# EAGLE design ESP32E_Double_RGB_RevA (EAGLE 9.6.2)
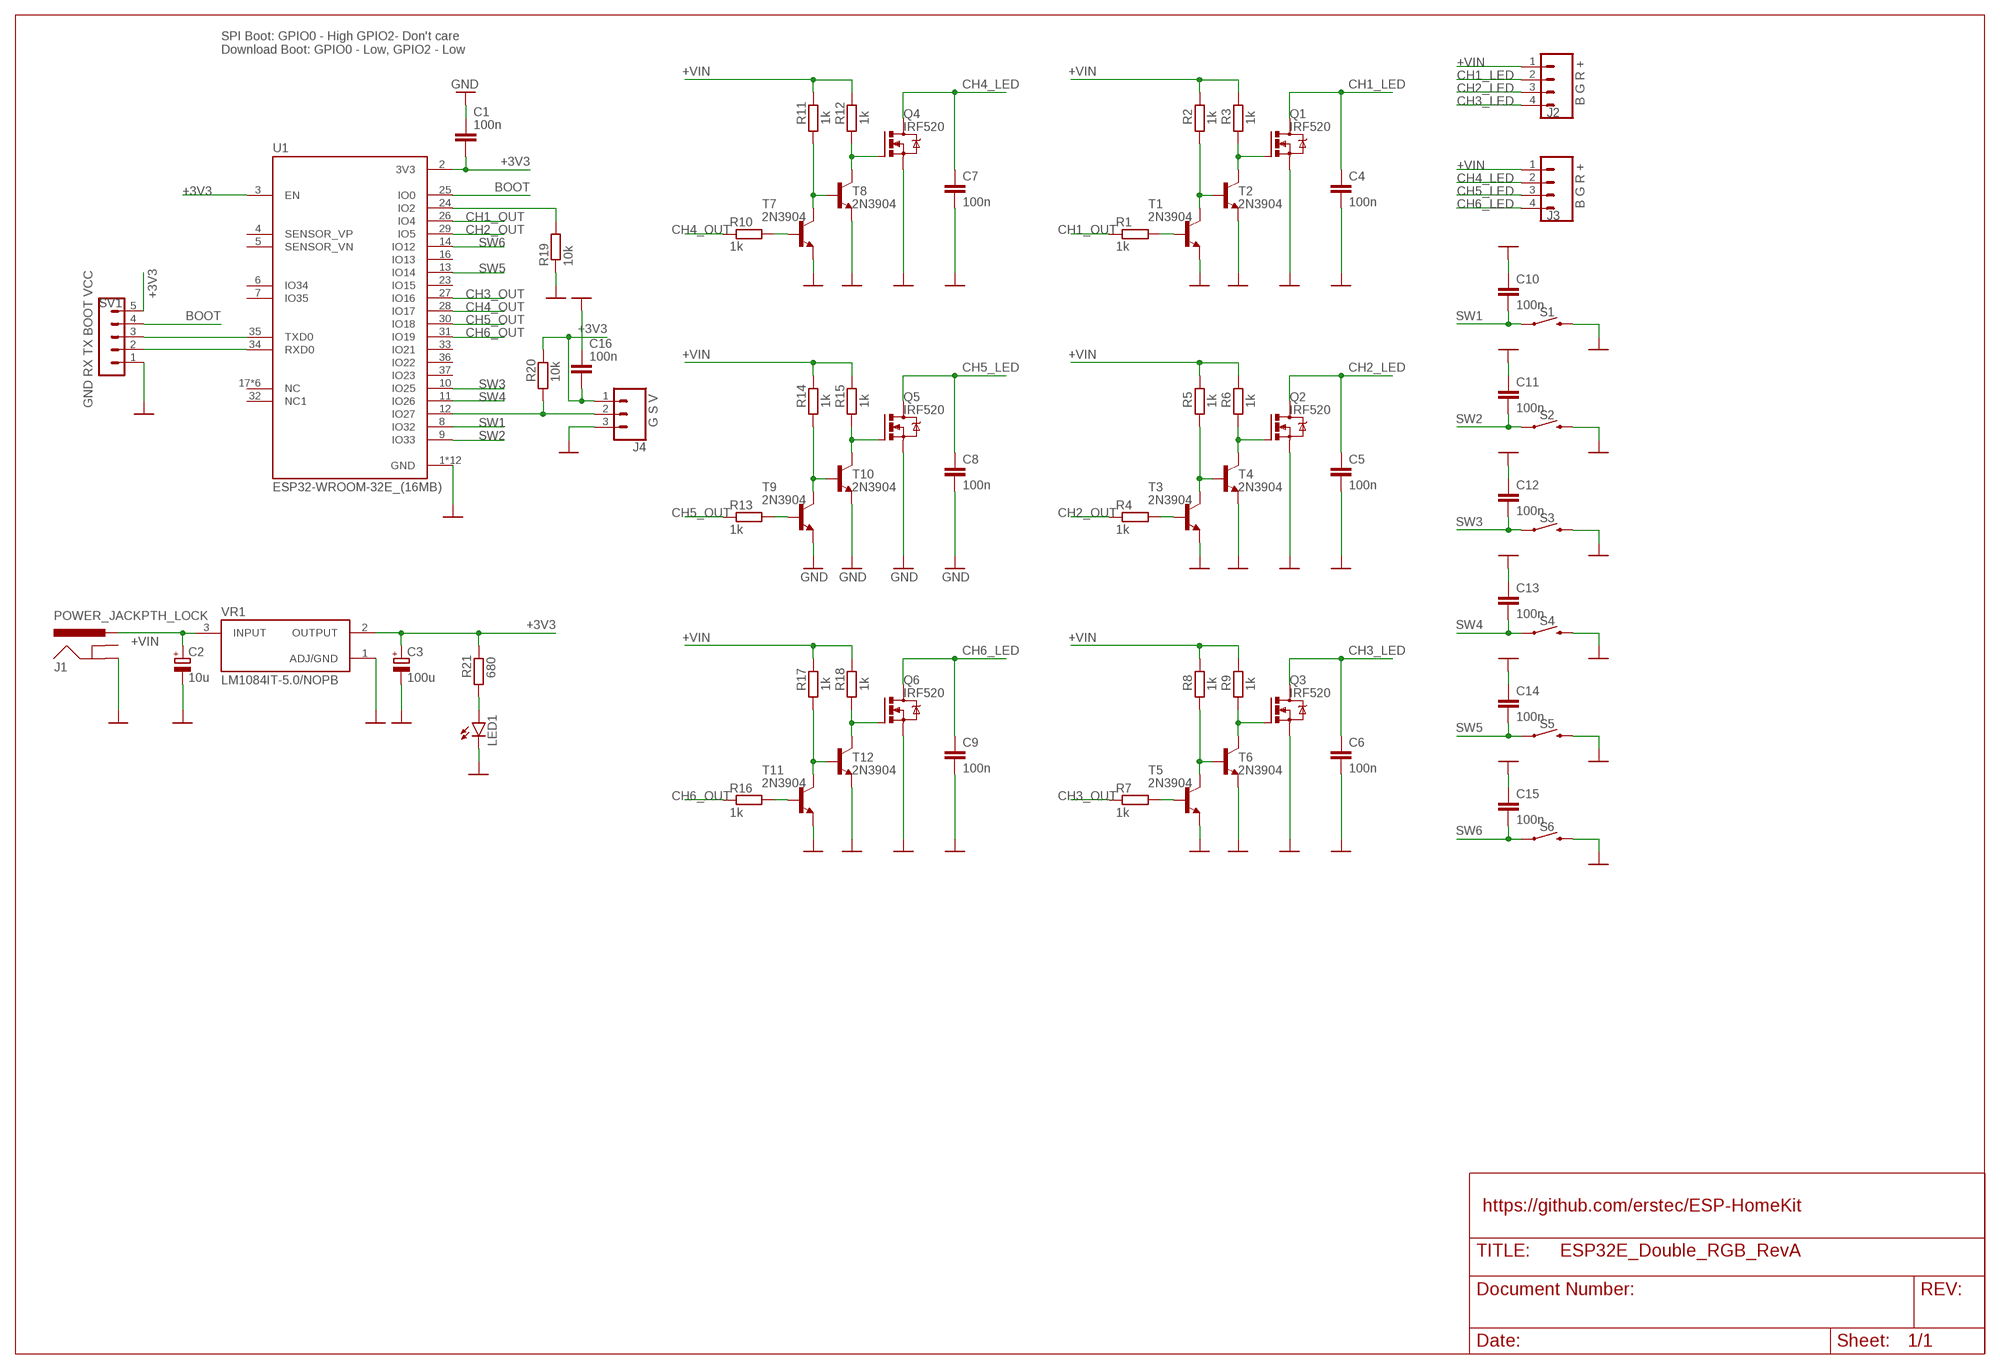
[diagram p0: schematic, sheet 1]

## Parts
C1  100n  C-EU025-024X044  [C025-024X044]
C2  10u  CPOL-EUE2,5-6E  [E2,5-6E]
C3  100u  CPOL-EUE2.5-6  [E2,5-6]
C4  100n  C-EU025-024X044  [C025-024X044]
C5  100n  C-EU025-024X044  [C025-024X044]
C6  100n  C-EU025-024X044  [C025-024X044]
C7  100n  C-EU025-024X044  [C025-024X044]
C8  100n  C-EU025-024X044  [C025-024X044]
C9  100n  C-EU025-024X044  [C025-024X044]
C10  100n  C-EU025-024X044  [C025-024X044]
C11  100n  C-EU025-024X044  [C025-024X044]
C12  100n  C-EU025-024X044  [C025-024X044]
C13  100n  C-EU025-024X044  [C025-024X044]
C14  100n  C-EU025-024X044  [C025-024X044]
C15  100n  C-EU025-024X044  [C025-024X044]
C16  100n  C-EU025-024X044  [C025-024X044]
J1  POWER_JACKPTH_LOCK  [POWER_JACK_PTH_LOCK]
J2  B G R +  CONN_04SCREW_LOCK  [SCREWTERMINAL-3.5MM-4_LOCK]
J3  B G R +  CONN_04SCREW_LOCK  [SCREWTERMINAL-3.5MM-4_LOCK]
J4  G S V  CONN_03SCREW_LOCK  [SCREWTERMINAL-3.5MM-3_LOCK.007S]
LED1  LED5MM  [LED5MM]
Q1  IRF520  [TO220BV]
Q2  IRF520  [TO220BV]
Q3  IRF520  [TO220BV]
Q4  IRF520  [TO220BV]
Q5  IRF520  [TO220BV]
Q6  IRF520  [TO220BV]
R1  1k  R-EU_0207/10  [0207/10]
R2  1k  R-EU_0207/10  [0207/10]
R3  1k  R-EU_0207/10  [0207/10]
R4  1k  R-EU_0207/10  [0207/10]
R5  1k  R-EU_0207/10  [0207/10]
R6  1k  R-EU_0207/10  [0207/10]
R7  1k  R-EU_0207/10  [0207/10]
R8  1k  R-EU_0207/10  [0207/10]
R9  1k  R-EU_0207/10  [0207/10]
R10  1k  R-EU_0207/10  [0207/10]
R11  1k  R-EU_0207/10  [0207/10]
R12  1k  R-EU_0207/10  [0207/10]
R13  1k  R-EU_0207/10  [0207/10]
R14  1k  R-EU_0207/10  [0207/10]
R15  1k  R-EU_0207/10  [0207/10]
R16  1k  R-EU_0207/10  [0207/10]
R17  1k  R-EU_0207/10  [0207/10]
R18  1k  R-EU_0207/10  [0207/10]
R19  10k  R-EU_0207/10  [0207/10]
R20  10k  R-EU_0207/10  [0207/10]
R21  680  R-EU_0207/10  [0207/10]
S1  MOMENTARY-SWITCH-SPST-PTH-6.0MM  [TACTILE_SWITCH_PTH_6.0MM]
S2  MOMENTARY-SWITCH-SPST-PTH-6.0MM  [TACTILE_SWITCH_PTH_6.0MM]
S3  MOMENTARY-SWITCH-SPST-PTH-6.0MM  [TACTILE_SWITCH_PTH_6.0MM]
S4  MOMENTARY-SWITCH-SPST-PTH-6.0MM  [TACTILE_SWITCH_PTH_6.0MM]
S5  MOMENTARY-SWITCH-SPST-PTH-6.0MM  [TACTILE_SWITCH_PTH_6.0MM]
S6  MOMENTARY-SWITCH-SPST-PTH-6.0MM  [TACTILE_SWITCH_PTH_6.0MM]
SV1  GND RX TX BOOT VCC  MA05-1  [MA05-1]
T1  2N3904  [TO92]
T2  2N3904  [TO92]
T3  2N3904  [TO92]
T4  2N3904  [TO92]
T5  2N3904  [TO92]
T6  2N3904  [TO92]
T7  2N3904  [TO92]
T8  2N3904  [TO92]
T9  2N3904  [TO92]
T10  2N3904  [TO92]
T11  2N3904  [TO92]
T12  2N3904  [TO92]
U1  ESP32-WROOM-32E_(16MB)  [XCVR_ESP32-WROOM-32E_(16MB)]
VR1  LM1084IT-5.0/NOPB  [TO254P1054X470X1955-3]

## Nets
+3V3: C1.2 C3.+ C16.2 J4.1 R20.2 R21.2 SV1.5 U1.2(3V3) U1.3(EN) VR1.2(OUTPUT)
+VIN: C2.+ J1.PWR J2.1 J3.1 R2.2 R3.2 R5.2 R6.2 R8.2 R9.2 R11.2 R12.2 R14.2 R15.2 R17.2 R18.2 VR1.3(INPUT)
BOOT: SV1.4 U1.25(IO0)
CH1_LED: C4.1 J2.2 Q1.D
CH1_OUT: R1.1 U1.26(IO4)
CH2_LED: C5.1 J2.3 Q2.D
CH2_OUT: R4.1 U1.29(IO5)
CH3_LED: C6.1 J2.4 Q3.D
CH3_OUT: R7.1 U1.27(IO16)
CH4_LED: C7.1 J3.2 Q4.D
CH4_OUT: R10.1 U1.28(IO17)
CH5_LED: C8.1 J3.3 Q5.D
CH5_OUT: R13.1 U1.30(IO18)
CH6_LED: C9.1 J3.4 Q6.D
CH6_OUT: R16.1 U1.31(IO19)
GND: C1.1 C2.- C3.- C4.2 C5.2 C6.2 C7.2 C8.2 C9.2 C10.1 C11.1 C12.1 C13.1 C14.1 C15.1 C16.1 J1.GND J4.3 LED1.K(C) Q1.S Q2.S Q3.S Q4.S Q5.S Q6.S R19.1 S1.3 S2.3 S3.3 S4.3 S5.3 S6.3 SV1.1 T1.3(E) T2.3(E) T3.3(E) T4.3(E) T5.3(E) T6.3(E) T7.3(E) T8.3(E) T9.3(E) T10.3(E) T11.3(E) T12.3(E) U1.1(GND) U1.15(GND) U1.38(GND) U1.39_1(GND) U1.39_2(GND) U1.39_3(GND) U1.39_4(GND) U1.39_5(GND) U1.39_6(GND) U1.39_7(GND) U1.39_8(GND) U1.39_9(GND) VR1.1(ADJ/GND)
N$1: R2.1 T1.1(C) T2.2(B)
N$2: R1.2 T1.2(B)
N$3: LED1.A R21.1
N$4: Q1.G R3.1 T2.1(C)
N$5: J4.2 R20.1 U1.12(IO27)
N$8: SV1.2 U1.34(RXD0)
N$9: SV1.3 U1.35(TXD0)
N$10: R5.1 T3.1(C) T4.2(B)
N$11: R4.2 T3.2(B)
N$13: Q2.G R6.1 T4.1(C)
N$16: R8.1 T5.1(C) T6.2(B)
N$17: R7.2 T5.2(B)
N$19: Q3.G R9.1 T6.1(C)
N$22: R11.1 T7.1(C) T8.2(B)
N$23: R10.2 T7.2(B)
N$25: Q4.G R12.1 T8.1(C)
N$28: R14.1 T9.1(C) T10.2(B)
N$29: R13.2 T9.2(B)
N$31: Q5.G R15.1 T10.1(C)
N$34: R17.1 T11.1(C) T12.2(B)
N$35: R16.2 T11.2(B)
N$37: Q6.G R18.1 T12.1(C)
N$40: R19.2 U1.24(IO2)
SW1: C10.2 S1.1 U1.8(IO32)
SW2: C11.2 S2.1 U1.9(IO33)
SW3: C12.2 S3.1 U1.10(IO25)
SW4: C13.2 S4.1 U1.11(IO26)
SW5: C14.2 S5.1 U1.13(IO14)
SW6: C15.2 S6.1 U1.14(IO12)
Unconnected: J1.GNDBREAK U1.4(SENSOR_VP) U1.5(SENSOR_VN) U1.6(IO34) U1.7(IO35) U1.16(IO13) U1.17(NC) U1.18(NC) U1.19(NC) U1.20(NC) U1.21(NC) U1.22(NC) U1.23(IO15) U1.32(NC1) U1.33(IO21) U1.36(IO22) U1.37(IO23)

## Notes on the sheet
- SPI Boot: GPIO0 - High GPIO2- Don't care
  Download Boot: GPIO0 - Low, GPIO2 - Low
- https://github.com/erstec/ESP-HomeKit

## Library data of the parts
C1 C4-C16 = rcl:C-EU: CAPACITOR, European symbol; SPICEPREFIX: C
C2 C3 = rcl:CPOL-EU: POLARIZED CAPACITOR, European symbol; SPICEPREFIX: C
J1 = SparkFun-Connectors:POWER_JACK: Power Jack Connector This is the standard 5.5mm barrel jack for power. The PTH is the most common, proven, reliable, footprint. The Slot footprint only works if the mill layer is transmitted to the PCB fab house so be warned. Here are the connectors we sell at SparkFun: DC Barrel Power Jack/Connector <https://www.sparkfun.com/products/119> (PRT-00119) DC Barrel Power Jack/Connector (SMD) <https://www.sparkfun.com/products/12748> (PRT-12748) DC Barrel Jack Adapter - Breadboard Compatible <https://www.sparkfun.com/products/10811> (PRT-10811) It is used on this SparkFun product (and many, many others): SparkFun RedBoard - Programmed with Arduino <https://www.sparkfun.com/products/12757> (DEV-12757) Also, if you need a mating power supply or connector, please check these out: Wall Adapter Power Supply - 9VDC 650mA <https://www.sparkfun.com/products/298> (TOL-00298) DC Barrel Jack Adapter - Male <https://www.sparkfun.com/products/10287> (PRT-10287); PROD_ID: CONN-08197; SF_ID: PRT-00119
J2 J3 = SparkFun-Connectors:CONN_04: Multi connection point. Often used as Generic Header-pin footprint for 0.1 inch spaced/style header connections On any of the 0.1 inch spaced packages, you can populate with these: Break Away Headers - Straight <https://www.sparkfun.com/products/116> (PRT-00116) Break Away Male Headers - Right Angle <https://www.sparkfun.com/products/553> (PRT-00553) Female Headers <https://www.sparkfun.com/products/115> (PRT-00115) Break Away Headers - Machine Pin <https://www.sparkfun.com/products/117> (PRT-00117) Break Away Female Headers - Swiss Machine Pin <https://www.sparkfun.com/products/743> (PRT-00743) For SCREWTERMINALS and SPRING TERMINALS visit here: Screw Terimnals on SparkFun.com <https://www.sparkfun.com/search/results?term=Screw+Terminals> (5mm/3.5mm/2.54mm spacing) This device is also useful as a general connection point to wire up your design to another part of your project. Our various solder wires solder well into these plated through hole pads. Hook-Up Wire - Assortment (Stranded, 22 AWG) <https://www.sparkfun.com/products/11375> (PRT-11375) Hook-Up Wire - Assortment (Solid Core, 22 AWG) <https://www.sparkfun.com/products/11367> (PRT-11367) View the entire wire category on our website here <https://www.sparkfun.com/categories/141> Special notes: Molex polarized connector foot print use with SKU : PRT-08231 with associated crimp pins and housings. 1MM SMD Version SKU: PRT-10208
J4 = SparkFun-Connectors:CONN_03: Multi connection point. Often used as Generic Header-pin footprint for 0.1 inch spaced/style header connections On any of the 0.1 inch spaced packages, you can populate with these: Break Away Headers - Straight <https://www.sparkfun.com/products/116> (PRT-00116) Break Away Male Headers - Right Angle <https://www.sparkfun.com/products/553> (PRT-00553) Female Headers <https://www.sparkfun.com/products/115> (PRT-00115) Break Away Headers - Machine Pin <https://www.sparkfun.com/products/117> (PRT-00117) Break Away Female Headers - Swiss Machine Pin <https://www.sparkfun.com/products/743> (PRT-00743) Stackable Header - 3 Pin (Female, 0.1") <https://www.sparkfun.com/products/13875> (PRT-13875) For SCREWTERMINALS and SPRING TERMINALS visit here: Screw Terimnals on SparkFun.com <https://www.sparkfun.com/search/results?term=Screw+Terminals> (5mm/3.5mm/2.54mm spacing) This device is also useful as a general connection point to wire up your design to another part of your project. Our various solder wires solder well into these plated through hole pads. Hook-Up Wire - Assortment (Stranded, 22 AWG) <https://www.sparkfun.com/products/11375> (PRT-11375) Hook-Up Wire - Assortment (Solid Core, 22 AWG) <https://www.sparkfun.com/products/11367> (PRT-11367) View the entire wire category on our website here <https://www.sparkfun.com/categories/141> Special notes: Molex polarized connector foot print use with SKU : PRT-08232 with associated crimp pins and housings.; PROD_ID: CONN-08288; SF_ID: PRT-08235
LED1 = led:LED: LED OSRAM: - CHIPLED LG R971, LG N971, LY N971, LG Q971, LY Q971, LO R971, LY R971 LH N974, LH R974 LS Q976, LO Q976, LY Q976 LO Q996 - Hyper CHIPLED LW Q18S LB Q993, LB Q99A, LB R99A - SideLED LS A670, LO A670, LY A670, LG A670, LP A670 LB A673, LV A673, LT A673, LW A673 LH A674 LY A675 LS A676, LA A676, LO A676, LY A676, LW A676 LS A679, LY A679, LG A679 - Hyper Micro SIDELED® LS Y876, LA Y876, LO Y876, LY Y876 LT Y87S - SmartLED LW L88C, LW L88S LB L89C, LB L89S, LG L890 LS L89K, LO L89K, LY L89K LS L896, LA L896, LO L896, LY L896 - TOPLED LS T670, LO T670, LY T670, LG T670, LP T670 LSG T670, LSP T670, LSY T670, LOP T670, LYG T670 LG T671, LOG T671, LSG T671 LB T673, LV T673, LT T673, LW T673 LH T674 LS T676, LA T676, LO T676, LY T676, LB T676, LH T676, LSB T676, LW T676 LB T67C, LV T67C, LT T67C, LS T67K, LO T67K, LY T67K, LW E67C LS E67B, LA E67B, LO E67B, LY E67B, LB E67C, LV E67C, LT E67C LW T67C LS T679, LY T679, LG T679 LS T770, LO T770, LY T770, LG T770, LP T770 LB T773, LV T773, LT T773, LW T773 LH T774 LS E675, LA E675, LY E675, LS T675 LS T776, LA T776, LO T776, LY T776, LB T776 LHGB T686 LT T68C, LB T68C - Hyper Mini TOPLED® LB M676 - Mini TOPLED Santana® LG M470 LS M47K, LO M47K, LY M47K Source: http://www.osram.convergy.de LUXEON: - LUMILED® LXK2-PW12-R00, LXK2-PW12-S00, LXK2-PW14-U00, LXK2-PW14-V00 LXK2-PM12-R00, LXK2-PM12-S00, LXK2-PM14-U00 LXK2-PE12-Q00, LXK2-PE12-R00, LXK2-PE12-S00, LXK2-PE14-T00, LXK2-PE14-U00 LXK2-PB12-K00, LXK2-PB12-L00, LXK2-PB12-M00, LXK2-PB14-N00, LXK2-PB14-P00, LXK2-PB14-Q00 LXK2-PR12-L00, LXK2-PR12-M00, LXK2-PR14-Q00, LXK2-PR14-R00 LXK2-PD12-Q00, LXK2-PD12-R00, LXK2-PD12-S00 LXK2-PH12-R00, LXK2-PH12-S00 LXK2-PL12-P00, LXK2-PL12-Q00, LXK2-PL12-R00 Source: www.luxeon.com KINGBRIGHT: KA-3528ASYC Source: www.kingbright.com
Q1-Q6 = transistor-power:IRF520: HEXFET Power MOSFET
R1-R21 = rcl:R-EU_: RESISTOR, European symbol; SPICEPREFIX: R
S1-S6 = SparkFun-Switches:MOMENTARY-SWITCH-SPST: Momentary Switch (Pushbutton) - SPST Normally-open (NO) SPST momentary switches (buttons, pushbuttons). Variants PTH-12MM - 12mm square, through-hole Momentary Pushbutton Switch - 12mm Square <https://www.sparkfun.com/products/9190> (COM-09190) PTH-6.0MM, PTH-6.0MM-KIT - 6.0mm square, through-hole Mini Pushbutton Switch <https://www.sparkfun.com/products/97> (COM-00097) KIT package intended for soldering kit's - only one side of pads' copper is exposed. PTH-RIGHT-ANGLE-KIT - Right-angle, through-hole Right Angle Tactile Button <https://www.sparkfun.com/products/10791> - Used on SparkFun BigTime Watch Kit <https://www.sparkfun.com/products/11734> SMD-12MM - 12mm square, surface-mount Tactile Button - SMD (12mm) <https://www.sparkfun.com/products/12993> (COM-12993) Used on SparkFun PicoBoard <https://www.sparkfun.com/products/11888> SMD-4.5MM - 4.5mm Square Trackball Switch Used on SparkFun Blackberry Trackballer Breakout <https://www.sparkfun.com/products/13169> SMD-4.6MMX2.8MM - 4.60mm x 2.80mm, surface mount Used on SparkFun Pro Micro - RP2040 <https://www.sparkfun.com/products/17717> SMD-5.2MM, SMD-5.2-REDUNDANT - 5.2mm square, surface-mount Mini Pushbutton Switch - SMD <https://www.sparkfun.com/products/8720> (COM-08720) Used on Arduino Pro Mini <https://www.sparkfun.com/products/11114> REDUNDANT package connects both switch circuits together SMD-6.0X3.5MM - 6.0 x 3.5mm, surface mount Momentary Reset Switch SMD <https://www.sparkfun.com/products/8229> (COM-08229) SMD-6.2MM-TALL - 6.2mm square, surface mount Tactile Button - SMD (6mm) <https://www.sparkfun.com/products/12992> Used on SparkFun Digital Sandbox <https://www.sparkfun.com/products/12651> SMD-RIGHT-ANGLE - Right-angle, surface mount Used on SparkFun Block for Intel® Edison - Arduino <https://www.sparkfun.com/products/13036>; PROD_ID: SWCH-08441; SF_SKU: COM-00097
SV1 = con-lstb:MA05-1: PIN HEADER; OC_FARNELL: unknown; OC_NEWARK: unknown
T1-T12 = transistor:2N3904: NPN TRANSISTOR
U1 = ESP32-WROOM-32E__16MB_:ESP32-WROOM-32E_(16MB): Check availability <https://pricing.snapeda.com/parts/ESP32-WROOM-32E%20%2816MB%29/Espressif%20Systems/view-part?ref=eda>; AVAILABILITY: Not in stock; DESCRIPTION: Bluetooth, WiFi 802.11b/g/n, Bluetooth v4.2 +EDR, Class 1, 2 and 3 Transceiver Module 2.4GHz ~ 2.5GHz Integrated, Trace Surface Mount; MF: Espressif Systems; MP: ESP32-WROOM-32E (16MB); PACKAGE: None; PRICE: None
VR1 = LM1084IT-5.0_NOPB:LM1084IT-5.0/NOPB: Check availability <https://pricing.snapeda.com/parts/LM1084IT-5.0/NOPB/Texas%20Instruments/view-part?ref=eda>; AVAILABILITY: In Stock; DESCRIPTION: 5.5-A, 29-V, linear voltage regulator; MF: Texas Instruments; MP: LM1084IT-5.0/NOPB; PACKAGE: TO-220-3 Texas Instruments; PRICE: None; PURCHASE-URL: https://pricing.snapeda.com/search/part/LM1084IT-5.0/NOPB/?ref=eda

## Board
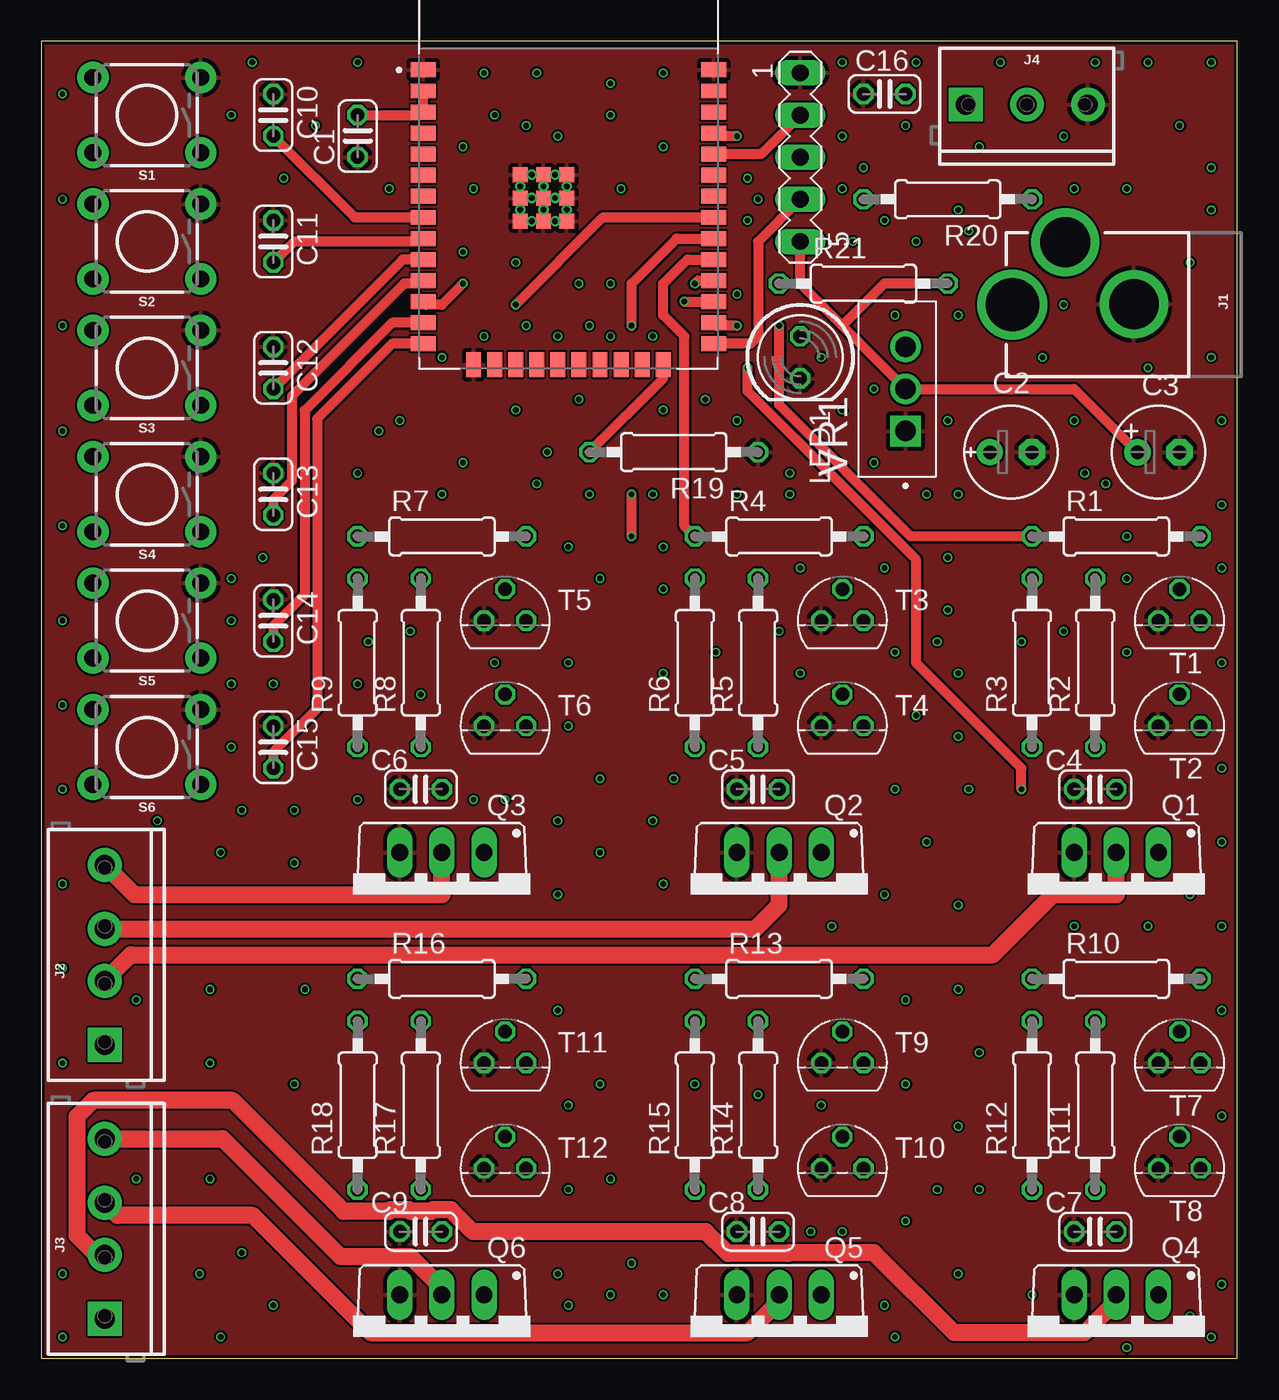
[diagram p1: board, top side]
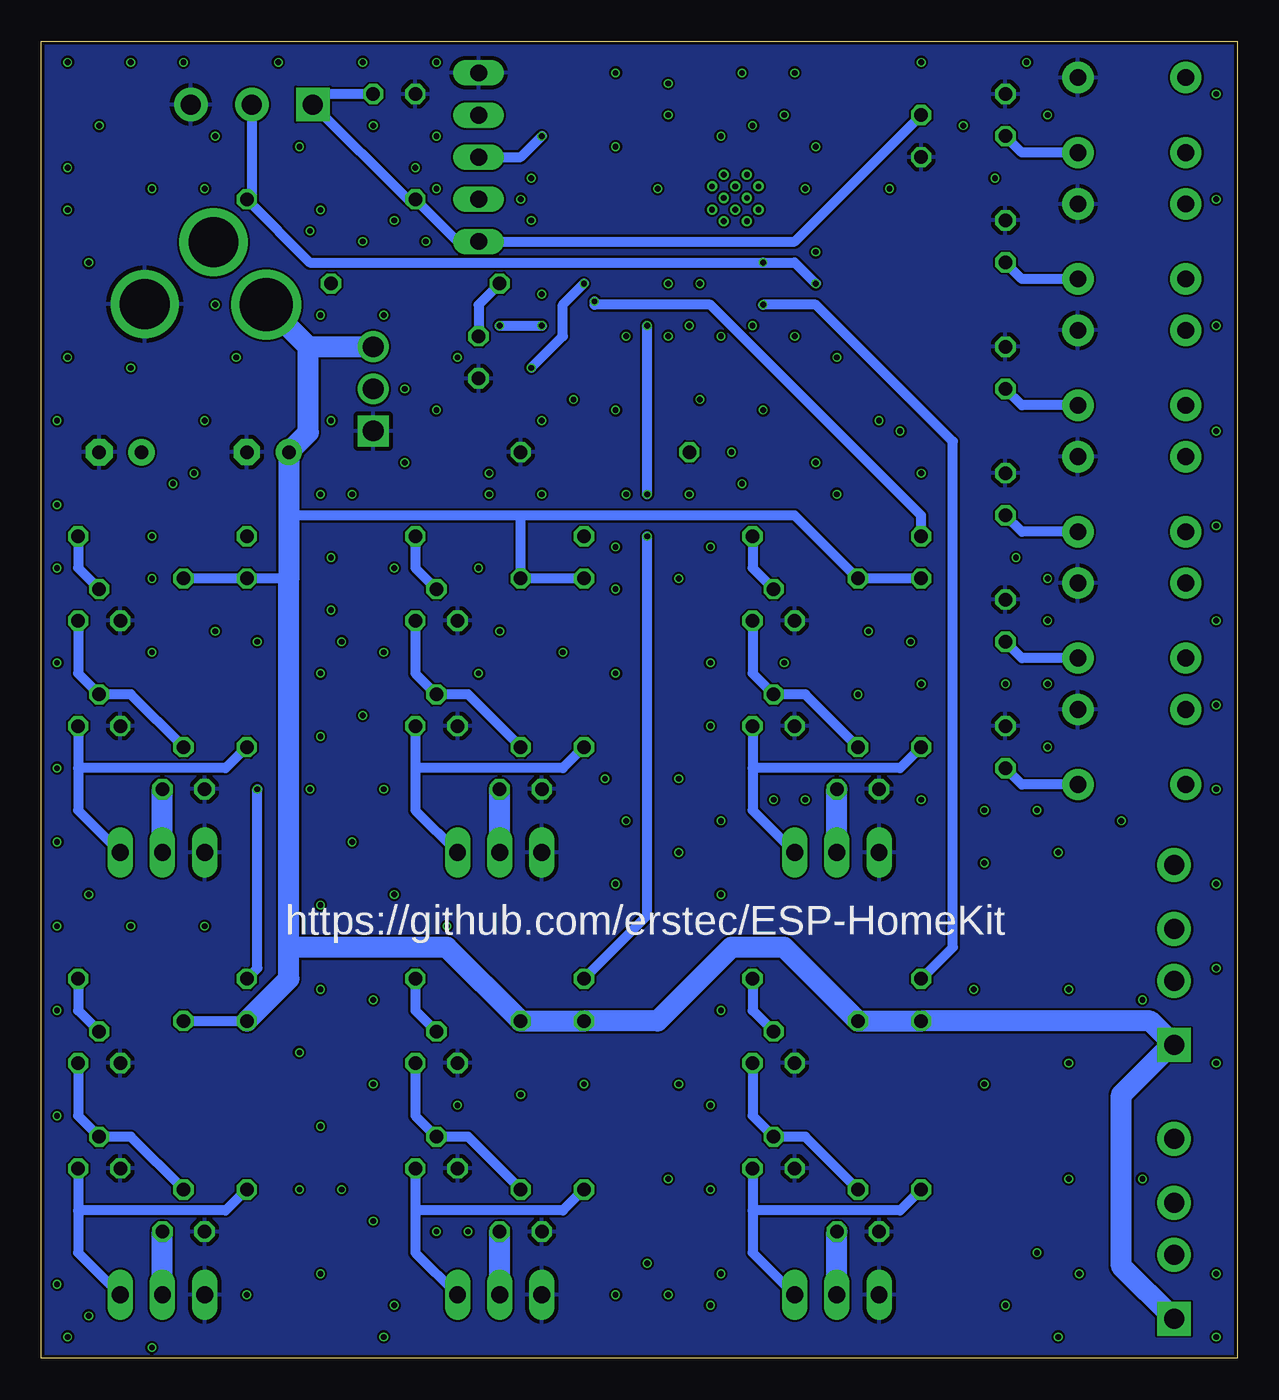
[diagram p2: board, bottom side, seen from below]

Size 72.06 x 79.36 mm. Coordinates in mm from the lower left corner, seen from the top.
Outline: 0,0 72.06,0 72.06,79.36 0,79.36 0,0
Copper layers (1*16): Top 0.035559375mm / dielectric 1.6mm / Bottom 0.035559375mm
Design rules "jlcpcb-2layers": minimum track width 5mil, minimum drill 12mil, track to track 5mil, track to pad 5mil, pad to pad 5mil, via to via 5mil, smd to smd 5mil, copper to edge 8mil, drill to drill 6mil, minimum pad ring 5mil, minimum via ring 3mil, stop-mask expansion 2.5mil, vias tented up to drill 0mil, thermal gap 10mil

### Footprints (pad centres in the part's own frame; a part is rotated, then mirrored left to right if it is on the bottom)
C025-024X044 = drill 0.813 octagon: 1 -1.27,0; 2 1.27,0
E2,5-6E = drill 0.813 pad 1.575: + -1.27,0 | drill 0.813 pad 1.575 octagon: - 1.27,0
E2,5-6 = drill 0.813 pad 1.6: + -1.27,0 | drill 0.813 pad 1.6 octagon: - 1.27,0
POWER_JACK_PTH_LOCK = drill 2.997 pad 4.115: GND 0.025,6.557; GNDBREAK 3.762,10.7 | drill 3.2 pad 4.115: PWR 0,13.878
SCREWTERMINAL-3.5MM-4_LOCK = drill 1.2 pad 2.032 square: 1 -0.178,0 | drill 1.2 pad 2.032: 2 3.678,0; 3 6.822,0; 4 10.678,0
SCREWTERMINAL-3.5MM-3_LOCK.007S = drill 1.2 pad 2.032 square: 1 -0.178,0 | drill 1.2 pad 2.032: 2 3.5,0; 3 7.178,0
LED5MM = drill 0.813 octagon: A -1.27,0; K 1.27,0
TO220BV = drill 1.016 long: D 0,-2.54; G -2.54,-2.54; S 2.54,-2.54
0207/10 = drill 0.813 octagon: 1 -5.08,0; 2 5.08,0
TACTILE_SWITCH_PTH_6.0MM = drill 1.016 pad 1.88: 1 -3.251,2.261; 2 3.251,2.261; 3 -3.251,-2.261; 4 3.251,-2.261
MA05-1 = drill 1.016 long: 1 -5.08,0; 2 -2.54,0; 3 0,0; 4 2.54,0; 5 5.08,0
TO92 = drill 0.813 octagon: 1 1.27,0; 2 0,1.905; 3 -1.27,0
XCVR_ESP32-WROOM-32E_(16MB) = smd 1.5 x 0.9: 1 -8.75,5.26; 2 -8.75,3.99; 3 -8.75,2.72; 4 -8.75,1.45; 5 -8.75,0.18; 6 -8.75,-1.09; 7 -8.75,-2.36; 8 -8.75,-3.63; 9 -8.75,-4.9; 10 -8.75,-6.17; 11 -8.75,-7.44; 12 -8.75,-8.71; 13 -8.75,-9.98; 14 -8.75,-11.25; 25 8.75,-11.25; 26 8.75,-9.98; 27 8.75,-8.71; 28 8.75,-7.44; 29 8.75,-6.17; 30 8.75,-4.9; 31 8.75,-3.63; 32 8.75,-2.36; 33 8.75,-1.09; 34 8.75,0.18; 35 8.75,1.45; 36 8.75,2.72; 37 8.75,3.99; 38 8.75,5.26 | smd 0.9 x 1.5: 15 -5.715,-12.5; 16 -4.445,-12.5; 17 -3.175,-12.5; 18 -1.905,-12.5; 19 -0.635,-12.5; 20 0.635,-12.5; 21 1.905,-12.5; 22 3.175,-12.5; 23 4.445,-12.5; 24 5.715,-12.5 | smd 0.9 x 0.9: 39_1 -2.9,-1.06; 39_2 -1.5,-1.06; 39_3 -0.1,-1.06; 39_4 -2.9,-2.46; 39_5 -1.5,-2.46; 39_6 -0.1,-2.46; 39_7 -2.9,-3.86; 39_8 -1.5,-3.86; 39_9 -0.1,-3.86 | drill 0.35 pad 0.61: 39_10 -2.2,-1.06; 39_11 -0.8,-1.06; 39_12 -2.9,-1.76; 39_13 -1.5,-1.76; 39_14 -0.1,-1.76; 39_15 -2.2,-2.46; 39_16 -0.8,-2.46; 39_17 -2.9,-3.16; 39_18 -1.5,-3.16; 39_19 -0.1,-3.16; 39_20 -2.2,-3.86; 39_21 -0.8,-3.86
TO254P1054X470X1955-3 = drill 1.24 square: 1 -2.54,0 | drill 1.24: 2 0,0; 3 2.54,0

### Placement (x,y rotation side)
C1  19.05,73.66 90 top
C2  58.42,54.61 0 top
C3  67.31,54.61 0 top
C4  63.5,34.29 180 top
C5  43.18,34.29 180 top
C6  22.86,34.29 180 top
C7  63.5,7.62 180 top
C8  43.18,7.62 180 top
C9  22.86,7.62 180 top
C10  13.97,74.93 270 top
C11  13.97,67.31 270 top
C12  13.97,59.69 270 top
C13  13.97,52.07 270 top
C14  13.97,44.45 270 top
C15  13.97,36.83 270 top
C16  50.8,76.2 0 top
J1  72.39,63.5 90 top
J2  3.81,19.05 90 top
J3  3.81,2.54 90 top
J4  55.88,75.56 0 top
LED1  45.72,60.33 270 top
Q1  64.77,27.94 180 top
Q2  44.45,27.94 180 top
Q3  24.13,27.94 180 top
Q4  64.77,1.27 180 top
Q5  44.45,1.27 180 top
Q6  24.13,1.27 180 top
R1  64.77,49.53 0 top
R2  63.5,41.91 90 top
R3  59.69,41.91 90 top
R4  44.45,49.53 0 top
R5  43.18,41.91 90 top
R6  39.37,41.91 90 top
R7  24.13,49.53 0 top
R8  22.86,41.91 90 top
R9  19.05,41.91 90 top
R10  64.77,22.86 0 top
R11  63.5,15.24 90 top
R12  59.69,15.24 90 top
R13  44.45,22.86 0 top
R14  43.18,15.24 90 top
R15  39.37,15.24 90 top
R16  24.13,22.86 0 top
R17  22.86,15.24 90 top
R18  19.05,15.24 90 top
R19  38.1,54.61 180 top
R20  54.61,69.85 180 top
R21  49.53,64.77 0 top
S1  6.35,74.93 180 top
S2  6.35,67.31 180 top
S3  6.35,59.69 180 top
S4  6.35,52.07 180 top
S5  6.35,44.45 180 top
S6  6.35,36.83 180 top
SV1  45.72,72.39 270 top
T1  68.58,44.45 0 top
T2  68.58,38.1 0 top
T3  48.26,44.45 0 top
T4  48.26,38.1 0 top
T5  27.94,44.45 0 top
T6  27.94,38.1 0 top
T7  68.58,17.78 0 top
T8  68.58,11.43 0 top
T9  48.26,17.78 0 top
T10  48.26,11.43 0 top
T11  27.94,17.78 0 top
T12  27.94,11.43 0 top
U1  31.75,72.39 0 top
VR1  52.07,58.42 90 top

### Tracks (layer width: path | path; a pad name or v marks a point on that pad's centre or on a via)
+3V3
  Top 0.61: C1.2 22.82,74.93 U1.3 U1.2 | C3.+ 62.23,58.42 VR1.2 48.26,62.23 | 48.26,62.23 45.72,64.77 SV1.5 | R21.2 50.8,64.77 48.26,62.23
  Bottom 0.61: C1.2 26.67,67.31 SV1.5 46.99,67.31 R20.2 49.99,69.85 J4.1 55.07,76.2 C16.2
+VIN
  Bottom 0.61: R11.2 R12.2 | R9.2 R8.2 26.67,50.8 43.18,50.8 | R6.2 R5.2 43.18,50.8 | R2.2 R3.2 57.15,46.99 | 43.18,50.8 57.15,50.8
  Bottom 1.27: J1.PWR 55.97,60.96 | 55.97,60.96 VR1.3 | 55.97,60.96 55.97,55.79 C2.+ 57.15,50.8 57.15,46.99 57.15,24.77 | R12.2 57.15,22.86 57.15,24.77 | 57.15,24.77 47.62,24.77 R14.2 R15.2 34.92,20.32 30.48,24.77 27.3,24.77 R17.2 R18.2 5.26,20.32 J2.1 3.99,18.87 6.99,15.88 6.99,5.54 J3.1
BOOT
  Top 0.61: SV1.4 43.18,67.31 43.18,61.59 42.73,61.14 U1.25
CH1_LED
  Top 1.016: J2.2 5.39,24.31 57.33,24.31 60.96,27.94 64.77,27.94 Q1.D
  Bottom 1.27: Q1.D C4.1
CH1_OUT  (via drill 0.35)
  Top 0.61: R1.1 52.38,49.53 44.45,57.46 v44.45,62.23 | v41.91,62.23 40.68,62.23 U1.26
  Bottom 0.61: v44.45,62.23 v41.91,62.23
CH2_LED
  Top 1.016: J2.3 43.02,25.87 44.45,27.3 Q2.D
  Bottom 1.27: Q2.D C5.1
CH2_OUT
  Top 0.61: R4.1 38.73,50.16 38.73,61.59 37.47,62.87 37.47,64.77 38.91,66.22 U1.29
CH3_LED
  Top 1.016: J2.4 5.6,27.94 24.13,27.94 Q3.D
  Bottom 1.27: Q3.D C6.1
CH3_OUT  (via drill 0.35)
  Top 0.61: v38.73,63.7 38.76,63.68 U1.27
  Bottom 0.61: R7.1 19.05,50.8 31.75,63.5 38.73,63.5 v38.73,63.7
CH4_LED
  Top 1.016: J3.2 3.31,6.22 2.13,7.4 2.13,14.55 3.12,15.53 11.52,15.53 18.21,8.84 20.94,8.84 21.04,8.94 22.14,8.94 22.24,8.84 23.48,8.84 23.58,8.94 24.68,8.94 26,7.62 40.04,7.62 41.36,6.3 45,6.3 45.05,6.35 50.16,6.35 54.99,1.52 62.87,1.52 64.77,3.43 Q4.D
  Bottom 1.27: Q4.D C7.1
CH4_OUT  (via drill 0.35)
  Top 0.61: v59.05,34.29 59.05,35.56 52.7,41.91 52.7,48.13 42.55,58.29 v42.55,59.69 | v39.37,64.77 39.55,64.95 U1.28
  Bottom 0.61: R10.1 59.05,23.5 v59.05,34.29 | v42.55,59.69 40.64,61.59 40.64,63.5 v39.37,64.77
CH5_LED
  Top 1.016: J3.3 4.57,8.6 12.74,8.6 19.81,1.52 42.55,1.52 44.45,3.43 Q5.D
  Bottom 1.27: Q5.D C8.1
CH5_OUT  (via drill 0.35)
  Top 0.61: v35.56,49.53 v35.56,52.07 | v35.56,62.23 35.56,64.77 38.28,67.49 U1.30
  Bottom 0.61: R13.1 35.56,26.67 v35.56,49.53 | v35.56,52.07 v35.56,62.23
CH6_LED
  Top 1.016: J3.4 10.91,13.22 18.01,6.12 22.23,6.12 24.13,4.22 Q6.D
  Bottom 1.27: Q6.D C9.1
CH6_OUT  (via drill 0.35)
  Top 0.61: v28.57,63.5 33.84,68.76 U1.31
  Bottom 0.61: R16.1 17.14,24.77 17.14,55.24 25.4,63.5 v28.57,63.5
GND
  Top 0.61: U1.39_5 U1.39_8
  pour Top: 0,79.38 72.39,79.38 72.39,0 0,0
  pour Bottom (rank 6): 0,79.38 72.39,79.38 72.39,0 0,0
N$1
  Bottom 0.61: T1.1 69.85,41.27 T2.2 66.67,40.01 R2.1
N$2
  Bottom 0.61: R1.2 69.85,47.62 T1.2
N$3
  Bottom 0.61: R21.1 45.72,63.5 LED1.A
N$4
  Bottom 0.61: T2.1 69.85,35.56 | 69.85,35.56 69.85,33.02 Q1.G | R3.1 60.96,35.56 69.85,35.56
N$5  (via drill 0.35)
  Top 0.61: v25.4,64.77 24.13,63.5 23.18,63.5 U1.12
  Bottom 0.61: J4.2 59.38,70.16 R20.1 55.88,66.04 v28.57,66.04 26.67,66.04 v25.4,64.77
N$6  (via drill 0.35)
  other vias: 1.27,76.2
N$7  (via drill 0.35)
  other vias: 1.27,69.85
N$8
  Top 0.61: SV1.2 43.36,72.57 U1.34
N$9  (via drill 0.35)
  Top 0.61: v41.91,73.66 40.68,73.66 U1.35
  Bottom 0.61: SV1.3 43.18,72.39 v41.91,73.66
N$10
  Bottom 0.61: T3.1 49.53,41.27 T4.2 46.35,40.01 R5.1
N$11
  Bottom 0.61: R4.2 49.53,47.62 T3.2
N$12  (via drill 0.35)
  other vias: 1.27,62.23
N$13
  Bottom 0.61: T4.1 49.53,35.56 | 49.53,35.56 49.53,33.02 Q2.G | R6.1 40.64,35.56 49.53,35.56
N$14  (via drill 0.35)
  other vias: 1.27,55.88
N$15  (via drill 0.35)
  other vias: 1.27,50.16
N$16
  Bottom 0.61: T5.1 29.21,41.27 T6.2 26.04,40.01 R8.1
N$17
  Bottom 0.61: R7.2 29.21,47.62 T5.2
N$18  (via drill 0.35)
  other vias: 1.27,44.45
N$19
  Bottom 0.61: T6.1 29.21,35.56 | 29.21,35.56 29.21,33.02 Q3.G | R9.1 20.32,35.56 29.21,35.56
N$20  (via drill 0.35)
  other vias: 1.27,39.37
N$21  (via drill 0.35)
  other vias: 1.27,34.29
N$22
  Bottom 0.61: T7.1 69.85,14.61 T8.2 66.67,13.34 R11.1
N$23
  Bottom 0.61: R10.2 69.85,20.95 T7.2
N$24  (via drill 0.35)
  other vias: 1.27,28.57
N$25
  Bottom 0.61: T8.1 69.85,8.89 | 69.85,8.89 69.85,6.35 Q4.G | R12.1 60.96,8.89 69.85,8.89
N$26  (via drill 0.35)
  other vias: 1.27,23.5
N$27  (via drill 0.35)
  other vias: 1.27,17.78
N$28
  Bottom 0.61: T9.1 49.53,14.61 T10.2 46.35,13.34 R14.1
N$29
  Bottom 0.61: R13.2 49.53,20.95 T9.2
N$30  (via drill 0.35)
  other vias: 1.27,5.08
N$31
  Bottom 0.61: T10.1 49.53,8.89 | 49.53,8.89 49.53,6.35 Q5.G | R15.1 40.64,8.89 49.53,8.89
N$32  (via drill 0.35)
  other vias: 1.27,1.27
N$33  (via drill 0.35)
  other vias: 10.79,1.27
N$34
  Bottom 0.61: T11.1 29.21,14.61 T12.2 26.04,13.34 R17.1
N$35
  Bottom 0.61: R16.2 29.21,20.95 T11.2
N$36  (via drill 0.35)
  other vias: 9.53,5.08
N$37
  Bottom 0.61: T12.1 29.21,8.89 | 29.21,8.89 29.21,6.35 Q6.G | R18.1 20.32,8.89 29.21,8.89
N$38  (via drill 0.35)
  other vias: 13.97,3.17
N$39  (via drill 0.35)
  other vias: 5.71,21.59
N$40
  Top 0.61: R19.2 37.47,59.05 U1.24
N$41  (via drill 0.35)
  other vias: 10.16,22.23
N$42  (via drill 0.35)
  other vias: 15.88,22.23
N$43  (via drill 0.35)
  other vias: 15.24,16.51
N$44  (via drill 0.35)
  other vias: 10.16,17.78
N$45  (via drill 0.35)
  other vias: 12.06,6.35
N$46  (via drill 0.35)
  other vias: 10.16,10.79
N$47  (via drill 0.35)
  other vias: 5.71,10.79
N$48  (via drill 0.35)
  other vias: 31.75,3.17
N$49  (via drill 0.35)
  other vias: 31.11,5.08
N$50  (via drill 0.35)
  other vias: 35.56,5.71
N$51  (via drill 0.35)
  other vias: 37.47,3.81
N$52  (via drill 0.35)
  other vias: 34.29,3.81
N$53  (via drill 0.35)
  other vias: 51.44,1.27
N$54  (via drill 0.35)
  other vias: 50.8,3.17
N$55  (via drill 0.35)
  other vias: 65.41,0.64
N$56  (via drill 0.35)
  other vias: 69.22,2.54
N$57  (via drill 0.35)
  other vias: 71.12,4.45
N$58  (via drill 0.35)
  other vias: 70.48,1.27
N$59  (via drill 0.35)
  other vias: 59.69,3.81
N$60  (via drill 0.35)
  other vias: 55.24,5.08
N$61  (via drill 0.35)
  other vias: 52.07,8.26
N$62  (via drill 0.35)
  other vias: 46.35,7.62
N$63  (via drill 0.35)
  other vias: 48.26,7.62
N$64  (via drill 0.35)
  other vias: 56.52,10.16
N$65  (via drill 0.35)
  other vias: 55.24,13.97
N$66  (via drill 0.35)
  other vias: 56.52,18.41
N$67  (via drill 0.35)
  other vias: 55.24,22.23
N$68  (via drill 0.35)
  other vias: 52.07,21.59
N$69  (via drill 0.35)
  other vias: 52.07,16.51
N$70  (via drill 0.35)
  other vias: 46.99,15.24
N$71  (via drill 0.35)
  other vias: 43.18,15.88
N$72  (via drill 0.35)
  other vias: 39.37,16.51
N$73  (via drill 0.35)
  other vias: 33.66,16.51
N$74  (via drill 0.35)
  other vias: 34.29,10.79
N$75  (via drill 0.35)
  other vias: 31.75,10.16
N$76  (via drill 0.35)
  other vias: 31.75,15.24
N$77  (via drill 0.35)
  other vias: 31.11,20.95
N$78  (via drill 0.35)
  other vias: 53.98,10.16
N$79  (via drill 0.35)
  other vias: 71.12,20.95
N$80  (via drill 0.35)
  other vias: 71.12,14.61
N$81  (via drill 0.35)
  other vias: 71.12,26.04
N$82  (via drill 0.35)
  other vias: 66.67,26.04
N$83  (via drill 0.35)
  other vias: 62.23,26.04
N$84  (via drill 0.35)
  other vias: 55.24,27.3
N$85  (via drill 0.35)
  other vias: 55.88,34.29
N$86  (via drill 0.35)
  other vias: 52.7,38.73
N$87  (via drill 0.35)
  other vias: 51.44,34.29
N$88  (via drill 0.35)
  other vias: 50.8,27.94
N$89  (via drill 0.35)
  other vias: 53.34,31.11
N$90  (via drill 0.35)
  other vias: 47.62,26.04
N$91  (via drill 0.35)
  other vias: 37.47,28.57
N$92  (via drill 0.35)
  other vias: 38.1,34.92
N$93  (via drill 0.35)
  other vias: 36.83,32.38
N$94  (via drill 0.35)
  other vias: 37.47,41.27
N$95  (via drill 0.35)
  other vias: 40.64,42.55
N$96  (via drill 0.35)
  other vias: 44.45,43.81
N$97  (via drill 0.35)
  other vias: 45.72,41.27
N$98  (via drill 0.35)
  other vias: 37.47,46.35
N$99  (via drill 0.35)
  other vias: 37.47,48.9
N$100  (via drill 0.35)
  other vias: 33.66,46.99
N$101  (via drill 0.35)
  other vias: 31.75,48.9
N$102  (via drill 0.35)
  other vias: 31.75,41.91
N$103  (via drill 0.35)
  other vias: 27.3,41.91
N$104  (via drill 0.35)
  other vias: 31.75,38.1
N$105  (via drill 0.35)
  other vias: 33.66,34.92
N$106  (via drill 0.35)
  other vias: 33.66,30.48
N$107  (via drill 0.35)
  other vias: 31.11,27.94
N$108  (via drill 0.35)
  other vias: 31.11,32.38
N$109  (via drill 0.35)
  other vias: 27.94,33.66
N$110  (via drill 0.35)
  other vias: 26.04,33.66
N$111  (via drill 0.35)
  other vias: 19.05,33.66
N$112  (via drill 0.35)
  other vias: 22.86,40.01
N$113  (via drill 0.35)
  other vias: 22.23,43.81
N$114  (via drill 0.35)
  other vias: 19.68,43.18
N$115  (via drill 0.35)
  other vias: 19.05,40.64
N$116  (via drill 0.35)
  other vias: 15.24,33.02
N$117  (via drill 0.35)
  other vias: 15.24,29.84
N$118  (via drill 0.35)
  other vias: 10.79,30.48
N$119  (via drill 0.35)
  other vias: 12.06,33.02
N$120  (via drill 0.35)
  other vias: 11.43,36.83
N$121  (via drill 0.35)
  other vias: 11.43,40.64
N$122  (via drill 0.35)
  other vias: 13.97,40.64
N$123  (via drill 0.35)
  other vias: 11.43,44.45
N$124  (via drill 0.35)
  other vias: 11.43,46.99
N$125  (via drill 0.35)
  other vias: 13.34,48.26
N$126  (via drill 0.35)
  other vias: 6.99,32.38
N$127  (via drill 0.35)
  other vias: 19.05,53.34
N$128  (via drill 0.35)
  other vias: 21.59,56.52
N$129  (via drill 0.35)
  other vias: 20.32,55.88
N$130  (via drill 0.35)
  other vias: 28.57,57.15
N$131  (via drill 0.35)
  other vias: 32.38,57.78
N$132  (via drill 0.35)
  other vias: 30.48,54.61
N$133  (via drill 0.35)
  other vias: 25.4,53.98
N$134  (via drill 0.35)
  other vias: 24.13,52.07
N$135  (via drill 0.35)
  other vias: 29.84,52.7
N$136  (via drill 0.35)
  other vias: 33.02,52.07
N$137  (via drill 0.35)
  other vias: 37.47,57.15
N$138  (via drill 0.35)
  other vias: 40.01,57.78
N$139  (via drill 0.35)
  other vias: 41.91,56.52
N$140  (via drill 0.35)
  other vias: 45.09,53.34
N$141  (via drill 0.35)
  other vias: 41.91,52.07
N$142  (via drill 0.35)
  other vias: 36.83,52.07
N$143  (via drill 0.35)
  other vias: 45.09,52.07
N$144  (via drill 0.35)
  other vias: 45.72,47.62
N$145  (via drill 0.35)
  other vias: 50.8,47.62
N$146  (via drill 0.35)
  other vias: 51.44,42.55
N$147  (via drill 0.35)
  other vias: 55.24,37.47
N$148  (via drill 0.35)
  other vias: 55.24,41.27
N$149  (via drill 0.35)
  other vias: 54.61,45.09
N$150  (via drill 0.35)
  other vias: 54.61,48.26
N$151  (via drill 0.35)
  other vias: 53.98,43.18
N$152  (via drill 0.35)
  other vias: 65.41,46.99
N$153  (via drill 0.35)
  other vias: 65.41,42.55
N$154  (via drill 0.35)
  other vias: 71.12,41.91
N$155  (via drill 0.35)
  other vias: 71.12,35.56
N$156  (via drill 0.35)
  other vias: 71.12,31.11
N$157  (via drill 0.35)
  other vias: 69.22,27.94
N$158  (via drill 0.35)
  other vias: 71.12,47.62
N$159  (via drill 0.35)
  other vias: 71.12,51.44
N$160  (via drill 0.35)
  other vias: 65.41,49.53
N$161  (via drill 0.35)
  other vias: 64.14,52.7
N$162  (via drill 0.35)
  other vias: 61.59,43.81
N$163  (via drill 0.35)
  other vias: 59.05,43.18
N$164  (via drill 0.35)
  other vias: 62.87,53.34
N$165  (via drill 0.35)
  other vias: 62.23,56.52
N$166  (via drill 0.35)
  other vias: 55.24,52.07
N$167  (via drill 0.35)
  other vias: 54.61,56.52
N$168  (via drill 0.35)
  other vias: 53.34,52.07
N$169  (via drill 0.35)
  other vias: 50.16,53.98
N$170  (via drill 0.35)
  other vias: 50.16,58.42
N$171  (via drill 0.35)
  other vias: 48.26,57.15
N$172  (via drill 0.35)
  other vias: 46.99,60.33
N$173  (via drill 0.35)
  other vias: 41.91,64.14
N$174  (via drill 0.35)
  other vias: 42.55,68.58
N$175  (via drill 0.35)
  other vias: 42.55,71.12
N$176  (via drill 0.35)
  other vias: 43.18,69.85
N$177  (via drill 0.35)
  other vias: 48.9,67.31
N$178  (via drill 0.35)
  other vias: 52.7,67.31
N$179  (via drill 0.35)
  other vias: 55.88,67.94
N$180  (via drill 0.35)
  other vias: 50.8,68.58
N$181  (via drill 0.35)
  other vias: 52.07,74.3
N$182  (via drill 0.35)
  other vias: 49.53,71.75
N$183  (via drill 0.35)
  other vias: 48.26,70.48
N$184  (via drill 0.35)
  other vias: 48.26,73.66
N$185  (via drill 0.35)
  other vias: 48.26,78.11
N$186  (via drill 0.35)
  other vias: 52.7,78.11
N$187  (via drill 0.35)
  other vias: 57.78,78.11
N$188  (via drill 0.35)
  other vias: 63.5,78.11
N$189  (via drill 0.35)
  other vias: 61.59,73.66
N$190  (via drill 0.35)
  other vias: 56.52,73.03
N$191  (via drill 0.35)
  other vias: 55.24,69.22
N$192  (via drill 0.35)
  other vias: 66.67,78.11
N$193  (via drill 0.35)
  other vias: 70.48,78.11
N$194  (via drill 0.35)
  other vias: 70.48,71.75
N$195  (via drill 0.35)
  other vias: 68.58,74.3
N$196  (via drill 0.35)
  other vias: 65.41,70.48
N$197  (via drill 0.35)
  other vias: 70.48,69.22
N$198  (via drill 0.35)
  other vias: 62.23,70.48
N$199  (via drill 0.35)
  other vias: 69.22,66.04
N$200  (via drill 0.35)
  other vias: 70.48,60.33
N$201  (via drill 0.35)
  other vias: 61.59,63.5
N$202  (via drill 0.35)
  other vias: 60.33,60.33
N$203  (via drill 0.35)
  other vias: 66.67,59.69
N$204  (via drill 0.35)
  other vias: 71.12,56.52
N$205  (via drill 0.35)
  other vias: 55.24,62.87
N$206  (via drill 0.35)
  other vias: 51.44,62.87
N$207  (via drill 0.35)
  other vias: 37.47,77.47
N$208  (via drill 0.35)
  other vias: 29.84,77.47
N$209  (via drill 0.35)
  other vias: 26.67,77.47
N$210  (via drill 0.35)
  other vias: 25.4,73.03
N$211  (via drill 0.35)
  other vias: 31.11,73.66
N$212  (via drill 0.35)
  other vias: 37.47,73.03
N$213  (via drill 0.35)
  other vias: 34.92,70.48
N$214  (via drill 0.35)
  other vias: 34.29,74.93
N$215  (via drill 0.35)
  other vias: 26.04,70.48
N$216  (via drill 0.35)
  other vias: 25.4,66.67
N$217  (via drill 0.35)
  other vias: 26.67,61.59
N$218  (via drill 0.35)
  other vias: 24.13,60.33
N$219  (via drill 0.35)
  other vias: 29.21,62.23
N$220  (via drill 0.35)
  other vias: 32.38,64.77
N$221  (via drill 0.35)
  other vias: 34.29,64.77
N$222  (via drill 0.35)
  other vias: 34.29,61.59
N$223  (via drill 0.35)
  other vias: 31.11,61.59
N$224  (via drill 0.35)
  other vias: 33.02,62.23
N$225  (via drill 0.35)
  other vias: 36.83,61.59
N$226  (via drill 0.35)
  other vias: 19.05,78.11
N$227  (via drill 0.35)
  other vias: 12.7,78.11
N$228  (via drill 0.35)
  other vias: 11.43,74.93
N$229  (via drill 0.35)
  other vias: 14.61,71.12
N$230  (via drill 0.35)
  other vias: 20.95,70.48
N$231  (via drill 0.35)
  other vias: 16.51,74.3
N$232  (via drill 0.35)
  other vias: 29.21,74.3
N$233  (via drill 0.35)
  other vias: 27.3,74.93
N$234  (via drill 0.35)
  other vias: 34.29,76.83
SW1
  Top 0.61: C10.2 18.87,68.76 U1.8
  Bottom 0.61: S1.1 12.98,72.67 C10.2
SW2
  Top 0.61: U1.9 22.82,67.31 15.24,67.31 C11.2
  Bottom 0.61: S2.1 12.98,65.05 C11.2
SW3
  Top 0.61: U1.10 21.77,66.22 C12.2
  Bottom 0.61: S3.1 12.98,57.43 C12.2
SW4
  Top 0.61: C13.2 13.97,51.76 15.09,52.88 15.09,58 21.86,64.77 22.82,64.77 U1.11
  Bottom 0.61: S4.1 12.98,49.81 C13.2
SW5
  Top 0.61: U1.13 21.14,62.41 15.85,57.12 15.85,46.02 13.97,44.14 C14.2
  Bottom 0.61: S5.1 12.98,42.19 C14.2
SW6
  Top 0.61: U1.14 21.14,61.14 16.61,56.62 16.61,39.16 13.97,36.52 C15.2
  Bottom 0.61: S6.1 12.98,34.57 C15.2

### Text on the board
bNames: https://github.com/erstec/ESP-HomeKit